# EAGLE design trackuino micro sensor mk2 (EAGLE 7.1.0)
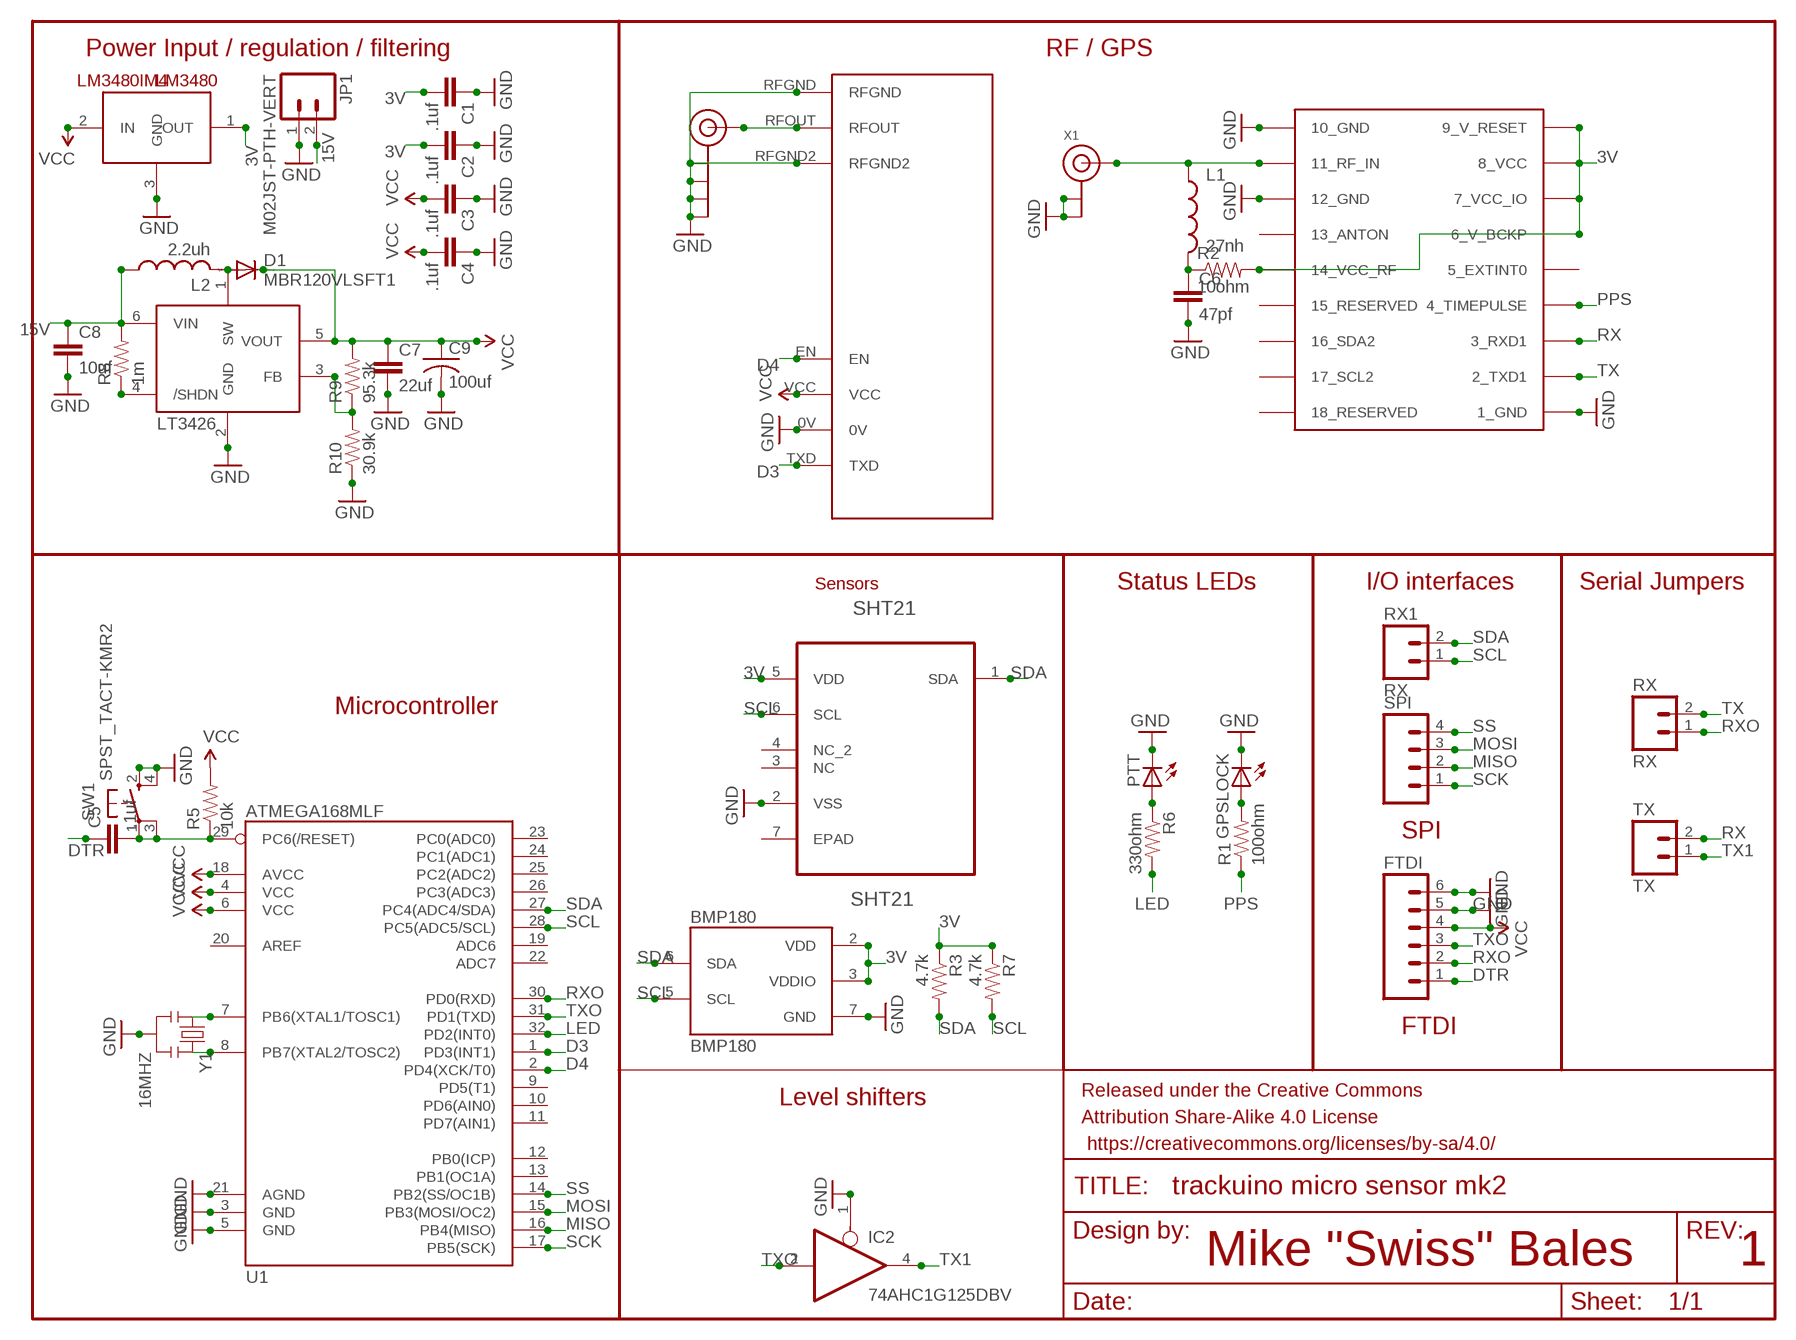
[diagram p0: schematic, sheet 1]

## Parts
BMP180  BMP180  [BMP180]
C1  .1uf  CAP0805  [0805]
C2  .1uf  CAP0805  [0805]
C3  .1uf  CAP0805  [0805]
C4  .1uf  CAP0805  [0805]
C5  .1uf  CAP0805  [0805]
C6  47pf  CAP0805  [0805]
C7  22uf  CAP0805  [0805]
C8  10uf  CAP0805  [0805]
C9  100uf  C-USC1206  [C1206]
D1  MBR120VLSFT1  DIODE-SOD123  [SOD123]
FRAME1  FRAME-LETTER  [CREATIVE_COMMONS]
FTDI  M06NO_SILK_FEMALE_PTH  [1X06_NO_SILK]
GPSLOCK  LEDCHIP-LED0805  [CHIP-LED0805]
IC2  74AHC1G125DBV  [SOT23-5]
J$1  SMA_EDGE  [SMA-EDGE]
JP1  M02JST-PTH-VERT  [JST-2-PTH-VERT]
L1  27nh  INDUCTOR0805  [0805]
L2  2.2uh  L-USL1812  [L1812]
LM3480  LM3480IM4  [SOT23-3]
LT3426  LT3426  [SOT23-6]
PTT  LEDCHIP-LED0805  [CHIP-LED0805]
R1  100ohm  RESISTOR0805-RES  [0805]
R2  10ohm  RESISTOR0805-RES  [0805]
R3  4.7k  RESISTOR0805-RES  [0805]
R5  10k  RESISTOR0805-RES  [0805]
R6  330ohm  RESISTOR0805-RES  [0805]
R7  4.7k  RESISTOR0805-RES  [0805]
R8  1m  RESISTOR0805-RES  [0805]
R9  95.3k  RESISTOR0805-RES  [0805]
R10  30.9k  RESISTOR0805-RES  [0805]
RX  RX  M02JST-PTH-VERT  [JST-2-PTH-VERT]
RX1  RX  M02JST-PTH-VERT  [JST-2-PTH-VERT]
SHT21  SHT21  [DFN300X300X110-7N]
SPI  M04JST-PTH-VERT  [JST-4-PTH-VERT]
SW1  SPST_TACT-KMR2  [KMR2]
TX  TX  M02JST-PTH-VERT  [JST-2-PTH-VERT]
U1  ATMEGA168MLF  [MLF32]
U$1  UBLOX_MAX  [UBLOX_MAX]
U$2  RADIOMETRIX-HX1  [RADIOMETRIX-HX1]
X1  ANTENNA_U.FL  [U.FL]
Y1  16MHZ  RESONATOR16MHZ  [RESONATOR-SMD]

## Nets
3V: BMP180.2(VDD) BMP180.3(VDDIO) C1.2 C2.2 LM3480.1(OUT) R2.2 R3.1 R7.1 SHT21.5(VDD) U$1.6_V_BCKP U$1.7_VCC_IO U$1.8_VCC U$1.9_V_RESET U$1.14_VCC_RF
15V: C8.1 JP1.2 L2.1 LT3426.6(VIN) R8.2
D3: U1.1(PD3(INT1)) U$2.TXD
D4: U1.2(PD4(XCK/T0)) U$2.EN
DTR: C5.1 FTDI.1
GND: BMP180.7(GND) C1.1 C2.1 C3.1 C4.1 C6.2 C7.2 C8.2 C9.2 FTDI.5 FTDI.6 GPSLOCK.C IC2.1(OE) J$1.GND@0(GND) J$1.GND@1(GND) J$1.GND@2(GND) J$1.GND@3(GND) JP1.1 LM3480.3(GND) LT3426.2(GND) PTT.C R10.1 SHT21.2(VSS) SW1.2(S) SW1.4(S1) U1.3(GND) U1.5(GND) U1.21(AGND) U$1.1_GND U$1.10_GND U$1.12_GND U$2.0V U$2.RFGND U$2.RFGND2 X1.1(GND) X1.2(GND) Y1.2
LED: R6.2 U1.32(PD2(INT0))
MISO: SPI.2 U1.16(PB4(MISO))
MOSI: SPI.3 U1.15(PB3(MOSI/OC2))
N$1: J$1.SIG(SIGNAL) U$2.RFOUT
N$3: GPSLOCK.A R1.2
N$6: L1.1 U$1.11_RF_IN X1.3(SIGNAL)
N$9: D1.A L2.2 LT3426.1(SW)
N$12: LT3426.4(/SHDN) R8.1
N$13: LT3426.3(FB) R9.1 R10.2
N$14: U1.8(PB7(XTAL2/TOSC2)) Y1.3
N$17: C5.2 R5.1 SW1.1(P) SW1.3(P1) U1.29(PC6(/RESET))
N$24: C6.1 L1.2 R2.1
N$26: U1.7(PB6(XTAL1/TOSC1)) Y1.1
N$27: PTT.A R6.1
PPS: R1.1 U$1.4_TIMEPULSE
RX: TX.2 U$1.3_RXD1
RXO: FTDI.2 RX.1 U1.30(PD0(RXD))
SCK: SPI.1 U1.17(PB5(SCK))
SCL: BMP180.5(SCL) R7.2 RX1.1 SHT21.6(SCL) U1.28(PC5(ADC5/SCL))
SDA: BMP180.6(SDA) R3.2 RX1.2 SHT21.1(SDA) U1.27(PC4(ADC4/SDA))
SS: SPI.4 U1.14(PB2(SS/OC1B))
TX: RX.2 U$1.2_TXD1
TX1: IC2.4(O) TX.1
TXO: FTDI.3 IC2.2(I) U1.31(PD1(TXD))
VCC: C3.2 C4.2 C7.1 C9.1 D1.C FTDI.4 LM3480.2(IN) LT3426.5(VOUT) R5.2 R9.2 U1.4(VCC) U1.6(VCC) U1.18(AVCC) U$2.VCC
Unconnected: SHT21.3(NC) SHT21.4(NC_2) SHT21.7(EPAD) U1.9(PD5(T1)) U1.10(PD6(AIN0)) U1.11(PD7(AIN1)) U1.12(PB0(ICP)) U1.13(PB1(OC1A)) U1.19(ADC6) U1.20(AREF) U1.22(ADC7) U1.23(PC0(ADC0)) U1.24(PC1(ADC1)) U1.25(PC2(ADC2)) U1.26(PC3(ADC3)) U$1.5_EXTINT0 U$1.13_ANTON U$1.15_RESERVED U$1.16_SDA2 U$1.17_SCL2 U$1.18_RESERVED

## Notes on the sheet
- Power Input / regulation / filtering | RF / GPS
- Sensors | Status LEDs | I/O interfaces | Serial Jumpers
- Microcontroller
- SPI
- FTDI
- Level shifters
- Mike "Swiss" Bales | 1

## Power pins joined to a net without a drawn wire
GND: IC2.3(GND)
VCC: IC2.5(VCC)

## Library data of the parts
BMP180 = SparkFun-Sensors:BMP180: BOSCH BMP180 DIGITAL BAROMETRIC PRESSURE SENSOR Web page: http://www.bosch-sensortec.com/en/homepage/products_3/environmental_sensors_1/bmp180_1/bmp180 Datasheet: http://ae-bst.resource.bosch.com/media/products/dokumente/bmp180/BST-BMP180-DS000-09.pdf The BMP180 is the function compatible successor of the BMP085, a new generation of high precision digital pressure sensors for consumer applications. The ultra-low power, low voltage electronics of the BMP180 is optimized for use in mobile phones, PDAs, GPS navigation devices and outdoor equipment. With a low altitude noise of merely 0.25m at fast conversion time, the BMP180 offers superior performance. The I2C interface allows for easy system integration with a microcontroller. The BMP180 is based on piezo-resistive technology for EMC robustness, high accuracy and linearity as well as long term stability. Key features: - Temperature measurement included - I2C interface - Fully calibrated - Pb-free, halogen-free and RoHS compliant, - MSL 1 Basic specs: Pressure range: 300 to 1100hPa (+9000m to -500m relating to sea level) Supply voltage: 1.8 to 3.6V (VDD), 1.62V to 3.6V (VDDIO) Package: LGA package with metal lid Small footprint: 3.6mm x 3.8mm Super-flat: 0.93mm height Low power: 5μA at 1 sample / sec. in standard mode Low noise: 0.06hPa (0.5m) in ultra low power mode, 0.02hPa (0.17m) advanced resolution mode Typical applications: - Enhancement of GPS navigation (dead-reckoning, slope detection, etc.) - In- and out-door navigation - Leisure and sports - Weather forecast - Vertical velocity indication (rise/sink speed)
C1-C8 = SparkFun-Capacitors:CAP: Capacitor Standard 0603 ceramic capacitor, and 0.1" leaded capacitor.
C9 = resistor:C-US: CAPACITOR, American symbol
D1 = diode:DIODE-: DIODE
FRAME1 = SparkFun-Aesthetics:FRAME-LETTER: Schematic Frame Standard 8.5x11 US Letter frame
FTDI = SparkFun-Connectors:M06: Header 6 Standard 6-pin 0.1" header. Use with straight break away headers (SKU : PRT-00116), right angle break away headers (PRT-00553), swiss pins (PRT-00743), machine pins (PRT-00117), and female headers (PRT-00115). Molex polarized connector foot print use with SKU : PRT-08094 with associated crimp pins and housings. NOTES ON THE VARIANTS LOCK and LOCK_LONGPADS... This footprint was designed to help hold the alignment of a through-hole component (i.e. 6-pin header) while soldering it into place. You may notice that each hole has been shifted either up or down by 0.005 of an inch from it's more standard position (which is a perfectly straight line). This slight alteration caused the pins (the squares in the middle) to touch the edges of the holes. Because they are alternating, it causes a "brace" to hold the component in place. 0.005 has proven to be the perfect amount of "off-center" position when using our standard breakaway headers. Although looks a little odd when you look at the bare footprint, once you have a header in there, the alteration is very hard to notice. Also,if you push a header all the way into place, it is covered up entirely on the bottom side. This idea of altering the position of holes to aid alignment will be further integrated into the Sparkfun Library for other footprints. It can help hold any component with 3 or more connection pins.; PROD_ID: CONN-08437
GPSLOCK PTT = adafruit:LED: LED OSRAM: - CHIPLED LG R971, LG N971, LY N971, LG Q971, LY Q971, LO R971, LY R971 LH N974, LH R974 LS Q976, LO Q976, LY Q976 LO Q996 - Hyper CHIPLED LW Q18S LB Q993, LB Q99A, LB R99A - SideLED LS A670, LO A670, LY A670, LG A670, LP A670 LB A673, LV A673, LT A673, LW A673 LH A674 LY A675 LS A676, LA A676, LO A676, LY A676, LW A676 LS A679, LY A679, LG A679 - Hyper Micro SIDELED® LS Y876, LA Y876, LO Y876, LY Y876 LT Y87S - SmartLED LW L88C, LW L88S LB L89C, LB L89S, LG L890 LS L89K, LO L89K, LY L89K LS L896, LA L896, LO L896, LY L896 - TOPLED LS T670, LO T670, LY T670, LG T670, LP T670 LSG T670, LSP T670, LSY T670, LOP T670, LYG T670 LG T671, LOG T671, LSG T671 LB T673, LV T673, LT T673, LW T673 LH T674 LS T676, LA T676, LO T676, LY T676, LB T676, LH T676, LSB T676, LW T676 LB T67C, LV T67C, LT T67C, LS T67K, LO T67K, LY T67K, LW E67C LS E67B, LA E67B, LO E67B, LY E67B, LB E67C, LV E67C, LT E67C LW T67C LS T679, LY T679, LG T679 LS T770, LO T770, LY T770, LG T770, LP T770 LB T773, LV T773, LT T773, LW T773 LH T774 LS E675, LA E675, LY E675, LS T675 LS T776, LA T776, LO T776, LY T776, LB T776 LHGB T686 LT T68C, LB T68C - Hyper Mini TOPLED® LB M676 - Mini TOPLED Santana® LG M470 LS M47K, LO M47K, LY M47K Source: http://www.osram.convergy.de/
IC2 = 74xx-little-us:74*1G125: Single Bus Buffer Gate with 3-State Output
J$1 = SparkFun-Connectors:SMA_EDGE: SMA Antenna Connector End launch SMA connector. The paste layer has been removed so that the connector can be hand soldered onto the board after reflow.
JP1 RX RX1 TX = SparkFun-Connectors:M02: Standard 2-pin 0.1" header. Use with - straight break away headers ( PRT-00116) - right angle break away headers (PRT-00553) - swiss pins (PRT-00743) - machine pins (PRT-00117) - female headers (PRT-00115) Molex polarized connector foot print use with: PRT-08233 with associated crimp pins and housings. 2.54_SCREWTERM for use with PRT-10571. 3.5mm Screw Terminal footprints for PRT-08084 5mm Screw Terminal footprints for use with PRT-08432
L1 = SparkFun-Passives:INDUCTOR: Inductors Basic Inductor/Choke - 0603 and 1206. Footprints are not proven and vary greatly between part numbers. SRN6045- 33uH, 20% 1.4A SDR0403-560KL - 56uH, 10%, 500mA RMS/740mA peak
L2 = resistor:L-US: INDUCTOR, American symbol
LM3480 = SparkFun-PowerIC:LM3480IM4: Small package linear regulator
LT3426 = adafruit:LT3426: LT3426 1.2MHz, 2A boost converter in SOT-23 http://www.linear.com/pc/productDetail.jsp?navId=H0,C1,C1003,C1042,C1031,C1061,P8430 (Linear website)
R1-R3 R5-R10 = SparkFun-Resistors:RESISTOR: Resistor Basic schematic elements and footprints for 0603, 1206, and PTH resistors.
SHT21 = sht21:SHT21: SENSOR, HUMIDITY & TEMP; MPN: SHT21; OC_FARNELL: 1855468; OC_NEWARK: 20T1172; PACKAGE: DFN-6; SUPPLIER: SENSIRION
SPI = SparkFun-Connectors:M04: Header 4 Standard 4-pin 0.1" header. Use with straight break away headers (SKU : PRT-00116), right angle break away headers (PRT-00553), swiss pins (PRT-00743), machine pins (PRT-00117), and female headers (PRT-00115). Molex polarized connector foot print use with SKU : PRT-08231 with associated crimp pins and housings. 1MM SMD Version SKU: PRT-10208
SW1 = adafruit:SPST_TACT: SMT 6mm switch, EVQQ2 series http://www.ladyada.net/library/eagle
U1 = SparkFun-DigitalIC:ATMEGA168: Atmel 32-pin 8-bit micro, 16k flash.
U$1 = Ava:UBLOX_MAX: UBLOX MAX
U$2 = Ava:RADIOMETRIX-HX1
X1 = adafruit:ANTENNA_U.FL: U.FL Antenna Connector
Y1 = SparkFun-FreqCtrl:RESONATOR: Resonator Small SMD resonator. Used, eg, on the Arduino Pro/ Pro Mini boards. 8MHz- XTAL-08895 16MHz- XTAL-08900; PROD_ID: XTAL-08900

## Board
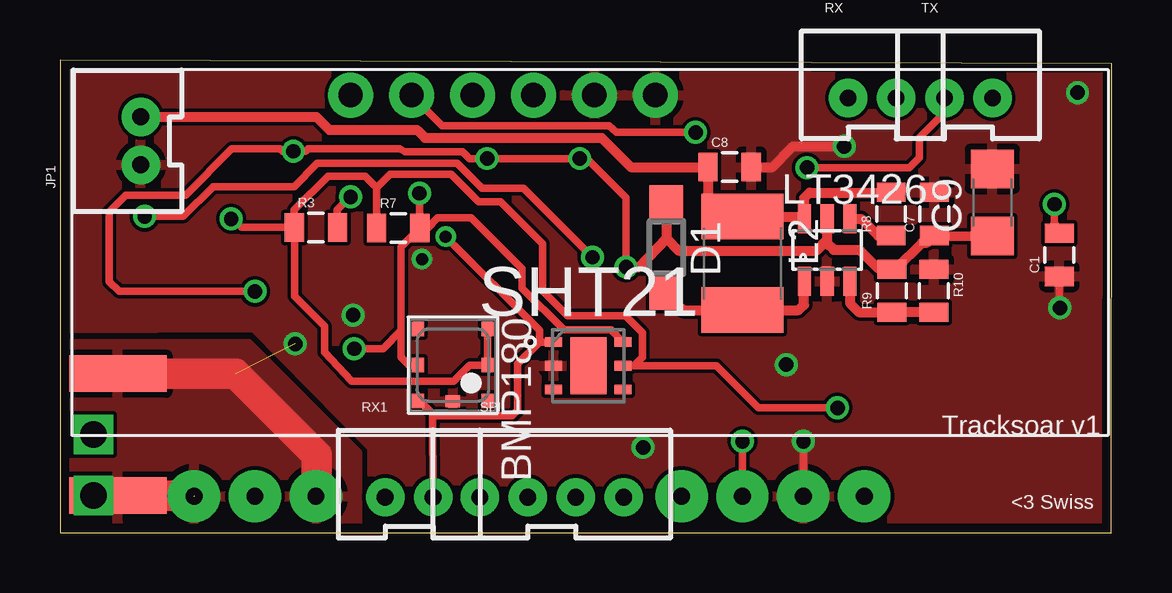
[diagram p1: board, top side]
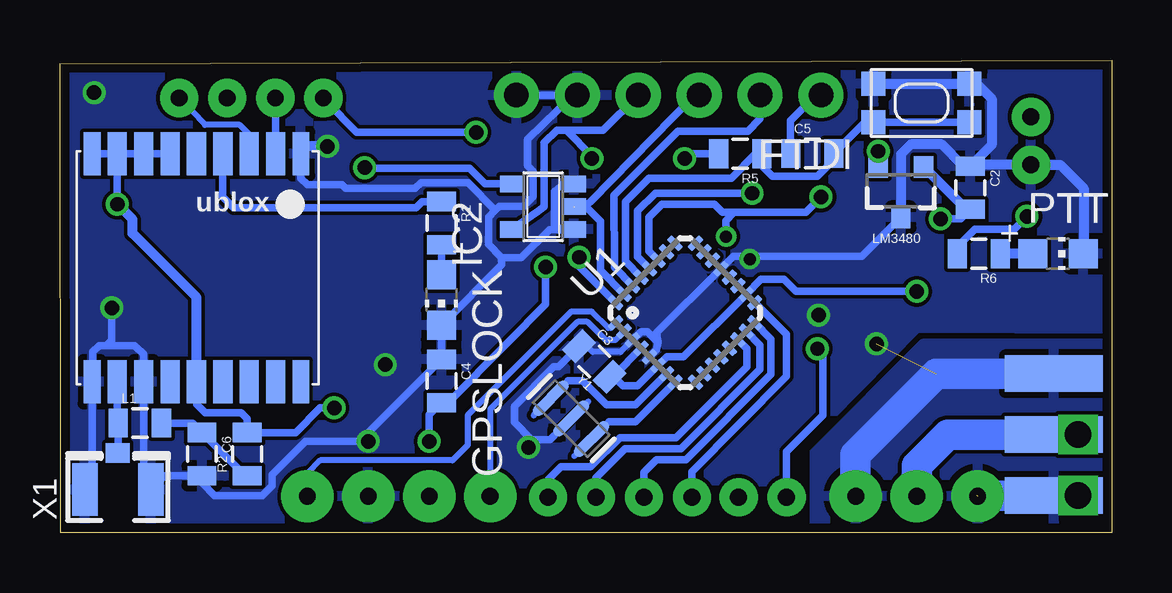
[diagram p2: board, bottom side, seen from below]

Size 43.84 x 19.7 mm. Coordinates in mm from the lower left corner, seen from the top.
Outline: 0,0 43.82,0 43.84,19.55 0,19.7 0,0
Copper layers (1*16): Top 0.0356mm / dielectric 1.5011mm / Bottom 0.0356mm
Design rules "oshpark-2layer": minimum track width 6mil, minimum drill 13mil, track to track 6mil, track to pad 6mil, pad to pad 6mil, via to via 6mil, smd to smd 6mil, copper to edge 15mil, drill to drill 6mil, minimum pad ring 7mil, minimum via ring 7mil, stop-mask expansion 4mil, vias tented up to drill 0mil, thermal gap 10mil

### Footprints (pad centres in the part's own frame; a part is rotated, then mirrored left to right if it is on the bottom)
BMP180 = smd 0.6 x 0.5: 1 1.5,1.45; 2 0,1.45; 3 -1.5,1.45; 4 -1.5,-1.45; 5 0,-1.45; 6 1.5,-1.45 | smd 0.5 x 0.6: 7 1.5,0
0805 = smd 0.8 x 1.2: 1 -0.9,0; 2 0.9,0
C1206 = smd 1.6 x 1.8: 1 -1.4,0; 2 1.4,0
SOD123 = smd 1.4 x 1.4: A 1.9,0; C -1.9,0
1X06_NO_SILK = drill 1.016 pad 1.88: 1 0,0; 2 2.54,0; 3 5.08,0; 4 7.62,0; 5 10.16,0; 6 12.7,0
CHIP-LED0805 = smd 1.2 x 1.2: A 0,-1.05; C 0,1.05
SOT23-5 = smd 0.69 x 0.99: 1 -0.95,-1.29; 2 0,-1.29; 3 0.95,-1.29; 4 0.95,1.3; 5 -0.95,1.3
SMA-EDGE = smd 1.524 x 4.064: GND@0 0,0; GND@1 5.08,0; SIG 2.54,0 | smd 1.524 x 4.064 bottom: GND@2 0,0; GND@3 5.08,0
JST-2-PTH-VERT = drill 0.7 pad 1.6: 1 -1,-0.55; 2 1,-0.55
L1812 = smd 1.9 x 3.4: 1 -1.95,0; 2 1.95,0
SOT23-3 = smd 0.8 x 0.9: 1 -0.95,-1; 2 0.95,-1; 3 0,1.1
SOT23-6 = smd 0.55 x 1.2: 1 -0.95,-1.3; 2 0,-1.3; 3 0.95,-1.3; 4 0.95,1.3; 5 0,1.3; 6 -0.95,1.3
DFN300X300X110-7N = smd 0.711 x 0.406: 1 -1.448,0.991; 2 -1.448,0; 3 -1.448,-0.991; 4 1.448,-0.991; 5 1.448,0; 6 1.448,0.991 | smd 1.499 x 2.388: 7 0,0
JST-4-PTH-VERT = drill 0.7 pad 1.6: 1 -3,-0.55; 2 -1,-0.55; 3 1,-0.55; 4 3,-0.55
KMR2 = smd 1 x 1: 1 2,0.8; 2 2,-0.8; 3 -2,0.8; 4 -2,-0.8
MLF32 = smd 0.7 x 0.3: 1 -2.35,1.75; 2 -2.35,1.25; 3 -2.35,0.75; 4 -2.35,0.25; 5 -2.35,-0.25; 6 -2.35,-0.75; 7 -2.35,-1.25; 8 -2.35,-1.75; 17 2.35,-1.75; 18 2.35,-1.25; 19 2.35,-0.75; 20 2.35,-0.25; 21 2.35,0.25; 22 2.35,0.75; 23 2.35,1.25; 24 2.35,1.75 | smd 0.3 x 0.7: 9 -1.75,-2.35; 10 -1.25,-2.35; 11 -0.75,-2.35; 12 -0.25,-2.35; 13 0.25,-2.35; 14 0.75,-2.35; 15 1.25,-2.35; 16 1.75,-2.35; 25 1.75,2.35; 26 1.25,2.35; 27 0.75,2.35; 28 0.25,2.35; 29 -0.25,2.35; 30 -0.75,2.35; 31 -1.25,2.35; 32 -1.75,2.35
UBLOX_MAX = smd 1.8 x 0.7: 1_GND 4.95,-4.4; 9_V_RESET 4.95,4.3; 10_GND -4.55,4.3; 18_RESERVED -4.55,-4.4 | smd 1.8 x 0.8: 2_TXD1 4.95,-3.35; 3_RXD1 4.95,-2.25; 4_TIMEPULSE 4.95,-1.15; 5_EXTINT0 4.95,-0.05; 6_V_BCKP 4.95,1.05; 7_VCC_IO 4.95,2.15; 8_VCC 4.95,3.25; 11_RF_IN -4.55,3.25; 12_GND -4.55,2.15; 13_ANTON -4.55,1.05; 14_VCC_RF -4.55,-0.05; 15_RESERVED -4.55,-1.15; 16_SDA2 -4.55,-2.25; 17_SCL2 -4.55,-3.35
RADIOMETRIX-HX1 = drill 0.7 pad 2.184: 0V 8.89,-10.16; EN 3.81,-10.16; RFGND -11.43,-10.16; RFGND2 -16.51,-10.16; RFOUT -13.97,-10.16; TXD 11.43,-10.16; VCC 6.35,-10.16
U.FL = smd 2.2 x 1.05: 1 0,1.375; 2 0,-1.375 | smd 0.8 x 1: 3 1.525,0
RESONATOR-SMD = smd 0.45 x 1.905: 1 -1.2,0; 2 0,0; 3 1.2,0

### Placement (x,y rotation side)
BMP180  16.38,6.99 270 top
C1  41.66,11.58 90 top
C2  5.89,14.38 270 bottom
C3  21.56,7.14 315 bottom
C4  27.94,6.32 270 bottom
C5  12.48,15.81 0 bottom
C6  37.92,3.28 270 bottom
C7  36.45,13.28 90 top
C8  27.91,15.24 0 top
C9  38.86,13.77 90 top
D1  25.27,11.89 270 top
FRAME1  14.78,-7.77 0 top  (outside the outline)
FTDI  12.12,18.24 180 bottom
GPSLOCK  27.94,9.7 180 bottom
IC2  23.7,13.59 90 bottom
J$1  2.41,1.55 90 bottom
JP1  2.82,16.33 90 top
L1  40.51,4.57 0 bottom
L2  28.45,11.23 270 top
LM3480  8.79,14.25 180 bottom
LT3426  31.98,11.79 0 top
PTT  2.24,11.63 270 bottom
R1  27.94,12.9 270 bottom
R2  36.04,3.28 90 bottom
R3  10.67,12.73 0 top
R5  15.48,15.79 180 bottom
R6  5.54,11.63 180 bottom
R7  14.1,12.7 0 top
R8  34.65,13.28 90 top
R9  34.67,10.08 90 top
R10  36.42,10.08 270 top
RX  33.86,18.67 0 top
RX1  14.55,2.03 0 top
SHT21  22.02,6.96 0 top
SPI  20.5,2.03 0 top
SW1  7.92,17.91 180 bottom
TX  37.87,18.67 0 top
U1  17.78,9.17 45 bottom
U$1  38.2,10.85 90 bottom
U$2  22.1,11.68 0 top
X1  41.43,1.8 90 bottom
Y1  22.53,4.76 315 bottom

### Tracks (layer width: path | path; a pad name or v marks a point on that pad's centre or on a via)
3V  (via drill 0.6)
  Top 0.305: R3.1 7.57,12.72 v7.14,13.08 | R3.1 9.77,13.45 11.18,14.86 12.73,14.86 13.21,14.38 | 13.21,14.38 13.21,12.71 R7.1 13.2,12.58 | 13.21,14.38 13.77,14.94 16.31,14.94 17.45,13.79 18.36,13.79 20.12,12.04 20.12,10.08 21.16,9.04 23.57,9.04 24.28,8.33 24.28,7.32 23.93,6.96 SHT21.5 27.36,6.96 29.11,5.21 v32.41,5.21 31.98,5.21 | v41.45,13.69 41.45,12.82 | R3.1 9.78,12.71 9.78,9.86 11.02,8.61 11.02,7.52 12.17,6.33 16.41,6.33 17.07,6.99 BMP180.2 BMP180.3
  Top 0.406: 41.45,12.82 41.45,12.69 C1.2
  Bottom 0.305: U$1.6_V_BCKP U$1.7_VCC_IO U$1.8_VCC | U$1.8_VCC U$1.9_V_RESET | U$1.14_VCC_RF 38.15,5.36 37.8,5 36.3,5 36.04,4.75 R2.2 34.03,4.18 32.99,5.21 v32.41,5.21 | v7.14,13.08 6.29,13.08 C2.2 | U$1.8_VCC 41.45,14.43 v41.45,13.69
  Bottom 0.406: C2.2 6.07,13.48 LM3480.1 | U$1.14_VCC_RF 38.15,9.8 40.82,12.47 40.82,13.06 v41.45,13.69
15V
  Top 0.406: JP1.2 10.68,17.33 11.23,16.79 14.88,16.79 15.21,16.46 22.58,16.46 23.8,15.24 C8.1 27.01,13.9 27.76,13.16 28.43,13.16 L2.1 30.94,13.18 LT3426.6 31.03,13.96 31.24,14.17 34.63,14.17 R8.2
D3
  Bottom 0.254: U1.1 20.89,8.53 20.98,8.53 21.67,9.22 22.53,9.22 26.85,4.9 26.85,3.66 27.48,3.02 32.99,3.02 33.53,2.49 U$2.TXD
D4
  Bottom 0.254: U1.2 20.69,8.03 21.08,8.03 21.84,8.79 22.28,8.79 25.91,5.16 U$2.EN
DTR
  Bottom 0.305: FTDI.1 12.32,18.24 13.39,17.17 C5.1
GND  (via drill 0.5, 0.6, 1.1)  (2 unrouted)
  Top 0.305: C1.1 41.66,9.4 v41.68,9.37 | U$2.0V v30.99,3.81
  Top 0.406: C8.2 29.69,15.24 30.56,16.1 v32.69,16.1
  Top 1.27: J$1.GND@1 7.32,6.63 10.69,3.25 10.69,1.55 U$2.RFGND | 2.31,1.55 5.61,1.55
  Bottom 0.254: U1.3 20.47,7.54 21.64,7.54 21.87,7.77 C3.1
  Bottom 0.305: U1.5 18.97,7.62 18.92,7.95 | 18.92,7.95 19.35,8.38 19.63,8.38 U1.3 | 18.92,7.95 18.97,8.33 U1.21 15.77,11.53 10.41,11.53 LM3480.3 | X1.1 42.5,2.1 U$1.10_GND 42.47,6.43 42.47,7.54 42.21,7.8 41.91,7.8 | 41.91,7.8 40.72,7.8 40.35,7.43 U$1.12_GND 40.35,2.1 X1.2 39.48,2.38 C6.2 37.92,2.08 37.39,1.55 35.41,1.55 35,1.96 35,2.41 33.6,3.81 v30.99,3.81 30.99,4.18 C4.1 GPSLOCK.C 25.43,11.17 25.43,11.46 | FTDI.6 22.45,18.24 | FTDI.5 22.45,18.24 | 22.45,18.24 24.36,16.41 24.36,15.29 24.13,15.06 24.13,14 24.51,13.61 25.53,13.61 25.7,13.44 | 25.7,13.44 25.98,13.16 25.98,12.01 25.43,11.46 | 25.43,11.46 24.61,11.46 23.44,12.62 22.96,12.62 | 22.96,12.62 22.42,12.62 IC2.1 | IC2.3 22.85,14.54 23.22,14.22 23.22,12.83 22.96,12.62 | U$1.1_GND 33.8,14.78 33.53,14.5 32.08,14.5 31.93,14.35 29.03,14.35 28.78,14.58 26.82,14.58 25.7,13.44 | v41.68,9.37 41.68,8.03 41.91,7.8 | C3.1 23.07,6.91 23.27,6.91 24.89,5.28 24.89,4.6 24.18,3.89 23.41,3.89 23.25,4.04
  Bottom 0.406: SW1.2 SW1.4 5.63,18.71 5,18.09 5,16.16 C2.1 | PTT.C 1.17,11.65 1.17,14.35 2.15,15.33 JP1.1 5.84,15.33 C2.1 | C2.1 6.18,15.28 7.09,16.18 8.38,16.18 8.79,15.77 LM3480.3 | v32.69,16.1 33.6,16.1 U$1.1_GND
  Bottom 1.27: U$2.RFGND2 5.56,1.55 J$1.GND@2 | J$1.GND@1 7.32,6.63 10.69,3.25 10.69,1.55 U$2.RFGND
  other vias: 30.28,7.01 42.42,18.34 9.8,7.87 15.09,11.4 12.22,9.07 1.4,1.55 24.31,3.56
  pour Bottom: 0,7.87 7.87,7.87 12.4,3.33 12.4,-0.03 0,-0.03
  pour Top: 0,7.87 7.87,7.87 12.4,3.33 12.4,-0.03 0,-0.03
  pour Top: 0,19.61 43.81,19.61 43.81,0 13.03,0 13.03,3.53 8.1,8.53 0,8.51
  pour Bottom: 0,19.61 43.81,19.61 43.81,0 13.03,0 13.03,3.53 8.1,8.53 0,8.51
LED  (via drill 0.6)
  Top 0.305: v3.53,13.18 5.13,13.18 6.38,14.43 9.75,14.43 10.72,15.39 16.56,15.39 17.6,14.35 19.33,14.35 v22.2,11.48
  Bottom 0.305: R6.2 6.44,11.93 5.72,12.65 4.06,12.65 v3.53,13.18 | v22.2,11.48 22.2,11.11 U1.32
MISO
  Bottom 0.305: SPI.2 19.5,2.52 18.97,3.05 17.75,3.05 14.2,6.6 14.2,8.06 U1.16
MOSI
  Bottom 0.305: SPI.3 21.5,2.3 20.29,3.5 17.96,3.5 14.66,6.81 14.66,7.81 U1.15
N$1
  Bottom 1.27: J$1.SIG 6.83,4.09 8.13,2.79 U$2.RFOUT
N$3
  Bottom 0.305: R1.2 GPSLOCK.A
N$6
  Bottom 0.305: U$1.11_RF_IN 41.45,4.69 L1.1 41.41,3.34 X1.3
N$9
  Top 0.406: LT3426.1 31.01,10.47 31.01,9.5 30.79,9.28 L2.2 25.99,9.28 D1.A
N$12
  Top 0.406: LT3426.4 33.4,13.09 34.11,12.37 34.63,12.37 R8.1
N$13
  Top 0.406: R10.2 R9.1 34.66,9.2 33.3,9.2 32.93,9.57 LT3426.3
N$14
  Bottom 0.305: U1.8 19.85,4.63 20.97,4.63
N$17
  Bottom 0.305: SW1.3 SW1.1 10.28,17.11 C5.2 11.58,15.55 12.27,14.86 14.15,14.86 14.55,15.27 14.55,15.76 R5.1 14.84,15.79 15.85,14.78 19.28,14.78 20.27,13.79 20.27,11.3 U1.29
N$18  (via drill 1.1)
  other vias: 1.4,4.09
N$24
  Bottom 0.305: R2.1 36.12,2.38 C6.1 38.32,4.57 L1.2
N$26
  Bottom 0.305: U1.7 19.85,5.33 21.06,5.33 22.05,6.33 22.66,6.33
N$27
  Bottom 0.406: PTT.A R6.1
PPS
  Bottom 0.305: R1.1 28.74,13.8 29.01,13.54 36.6,13.54 37.06,14 U$1.4_TIMEPULSE
RX
  Bottom 0.254: U$1.3_RXD1 35.95,16.6 36.35,16.99 37.8,16.99 TX.2
RXO  (via drill 0.6)
  Top 0.305: v26.49,16.69 23.19,16.69 22.89,16.97 15.93,16.97 FTDI.2
  Bottom 0.305: U1.30 20.73,11.05 20.75,14.07 18.08,16.74 15.16,16.74 14.66,17.25 FTDI.2 | RX.1 31.95,17.17 31.47,16.69 v26.49,16.69
SCK
  Bottom 0.305: SPI.1 17.5,2.54 13.56,6.53 13.56,8.28 U1.17
SCL  (via drill 0.6)
  Top 0.305: R7.2 15,13.65 v14.99,14.15 | BMP180.5 14.58,6.96 14.22,7.32 14.22,8.43 | 14.22,8.43 14.22,11.93 R7.2 | SHT21.6 22.96,8.46 21.01,8.46 19.27,10.2 U1.28 17.14,13.13 15.75,13.13 15.32,12.7 R7.2 | v12.27,7.67 13.46,7.67 14.22,8.43
  Bottom 0.305: U1.28 19.76,11.5 19.76,13.41 19.02,14.15 v14.99,14.15 | RX1.1 13.55,3.39 12.04,4.9 12.04,7.44 v12.27,7.67
SDA  (via drill 0.5 pad 0.25, 0.6)
  Top 0.305: v12.12,14 12.09,14 11.56,13.46 11.56,12.74 R3.2 | BMP180.6 15.16,5.34 15.41,5.09 | 15.41,5.09 15.62,4.88 18.85,4.88 19.08,5.11 19.08,7.04 19.99,7.95 | 19.99,7.95 SHT21.1 20.42,7.95 | RX1.2 15.53,4.96 15.41,5.09 | 19.99,7.95 19.99,8.43 v16.08,12.34
  Bottom 0.305: U1.27 19.28,11.73 19.28,13.16 18.75,13.69 16.56,13.69 16.23,13.36 15.75,13.36 | 15.75,13.36 12.75,13.36 v12.12,14 | v16.08,12.34 16.08,13.01 15.75,13.36
SS
  Bottom 0.305: SPI.4 23.5,2.21 22.96,2.74 21.72,2.74 20.5,3.96 18.16,3.96 15.21,6.91 15.21,7.67 U1.14
TX
  Bottom 0.305: RX.2 34.85,15.9 U$1.2_TXD1
TX1  (via drill 0.6)
  Top 0.305: v31.14,15.21 35.41,15.21 35.81,15.62 35.81,16.46 36.88,17.53 TX.1
  Bottom 0.305: IC2.4 26.12,14.54 26.77,15.19 31.13,15.2 v31.14,15.21
TXO
  Bottom 0.305: FTDI.3 17.42,18.19 21.69,13.84 21.84,13.69 22,13.69 | 22,13.69 22.28,13.72 IC2.2 | U1.31 21.31,10.93 21.31,12.98 21.92,13.59 22,13.69
VCC  (via drill 0.6)
  Top 0.305: v8.13,10.06 2.46,10.06 2.06,10.46 2.06,13.39 2.74,14.07 5.23,14.07 7.16,16 9.17,16 9.27,15.9 v9.73,15.9 10.24,15.9 10.34,16 14.15,16 14.38,15.88 16.79,15.88 17.07,15.6 v17.81,15.6 v21.67,15.6 21.97,15.6 23.6,13.97 v23.6,11.07 | U$2.VCC v28.45,3.81
  Top 0.406: 34.63,11.02 34.09,11.02 33.32,11.79 32.26,11.79 31.98,12.06 LT3426.5 31.98,12.19 31.55,11.76 25.78,11.76 25.27,12.27 | 34.63,11.02 R9.2 | 34.63,11.02 34.87,11.02 35.94,12.09 36.16,12.09 C7.1 36.61,12.38 C9.1 | D1.C 25.27,12.27 | v23.6,11.07 24.13,11.07 25.27,12.27
  Bottom 0.305: U1.4 20.75,6.55 C3.2 20.78,6.53 20.37,6.12 19.77,6.12 U1.6 18.54,7.34 17.84,7.34 U1.18 14.62,10.57 13.67,10.57 13.16,10.06 v8.13,10.06 | IC2.5 23.91,13.4 23.67,13.59 23.67,16.26 23.11,16.76 22.73,16.76 | 22.73,16.76 21.21,16.76 FTDI.4 | v9.73,15.9 LM3480.2 | R5.2 17.46,15.79 v17.81,15.6 | v21.67,15.6 21.67,15.7 22.73,16.76 | v28.45,3.81 28.45,4.92 C4.2 27.67,5.42 25.2,7.9 23.6,9.53 v23.6,11.07

### Text on the board
tNames: Tracksoar v1 | <3 Swiss